# EAGLE schematic to_be_corrected (EAGLE 7.2.0)
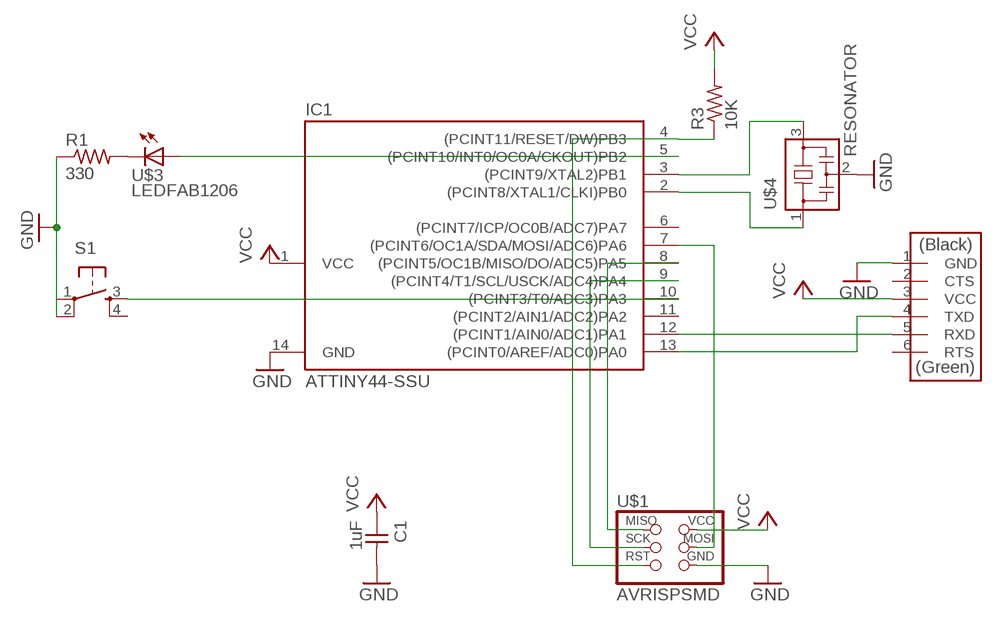
[diagram p0: schematic, sheet 1]

## Parts
C1  1uF  CAP-UNPOLARIZEDFAB  [C1206FAB]
IC1  ATTINY44-SSU  [SOIC14]
R1  330  RES-US1206FAB  [R1206FAB]
R3  10K  RES-US1206FAB  [R1206FAB]
S1  6MM_SWITCH6MM_SWITCH  [6MM_SWITCH]
U$1  AVRISPSMD  [2X03SMD]
U$2  FTDI-SMD-HEADER  [1X06SMD]
U$3  LEDFAB1206  [LED1206FAB]
U$4  RESONATOR  [EFOBM]

## Nets
GND: C1.2 IC1.14(GND) R1.1 S1.2(P1) U$1.6(GND) U$2.1(GND) U$4.2
N$1: IC1.5((PCINT10/INT0/OC0A/CKOUT)PB2) U$3.1(A)
N$2: IC1.13((PCINT0/AREF/ADC0)PA0) U$2.4(TXD)
N$3: IC1.4((PCINT11/RESET/DW)PB3) R3.1 U$1.5(RST)
N$4: IC1.3((PCINT9/XTAL2)PB1) U$4.3
N$5: IC1.2((PCINT8/XTAL1/CLKI)PB0) U$4.1
N$6: IC1.8((PCINT5/OC1B/MISO/DO/ADC5)PA5) U$1.1(MISO)
N$7: IC1.7((PCINT6/OC1A/SDA/MOSI/ADC6)PA6) U$1.4(MOSI)
N$8: IC1.9((PCINT4/T1/SCL/USCK/ADC4)PA4) U$1.3(SCK)
N$10: R1.2 U$3.2(C)
N$13: IC1.10((PCINT3/T0/ADC3)PA3) S1.3(S)
N$14: IC1.12((PCINT1/AIN0/ADC1)PA1) U$2.5(RXD)
VCC: C1.1 IC1.1(VCC) R3.2 U$1.2(VCC) U$2.3(VCC)
Unconnected: IC1.6((PCINT7/ICP/OC0B/ADC7)PA7) IC1.11((PCINT2/AIN1/ADC2)PA2) S1.1(P) S1.4(S1) U$2.2(CTS) U$2.6(RTS)

## Library data of the parts
C1 = fab:CAP-UNPOLARIZED
IC1 = fab:ATTINY44
R1 R3 = fab:RES-US: Resistor (US Symbol) Variants with postfix FAB are widened to allow the routing of internal traces
S1 = fab:6MM_SWITCH: OMRON SWITCH
U$1 = fab:AVRISP
U$2 = fab:FTDI-SMD-HEADER
U$3 = fab:LED: LED
U$4 = fab:RESONATOR